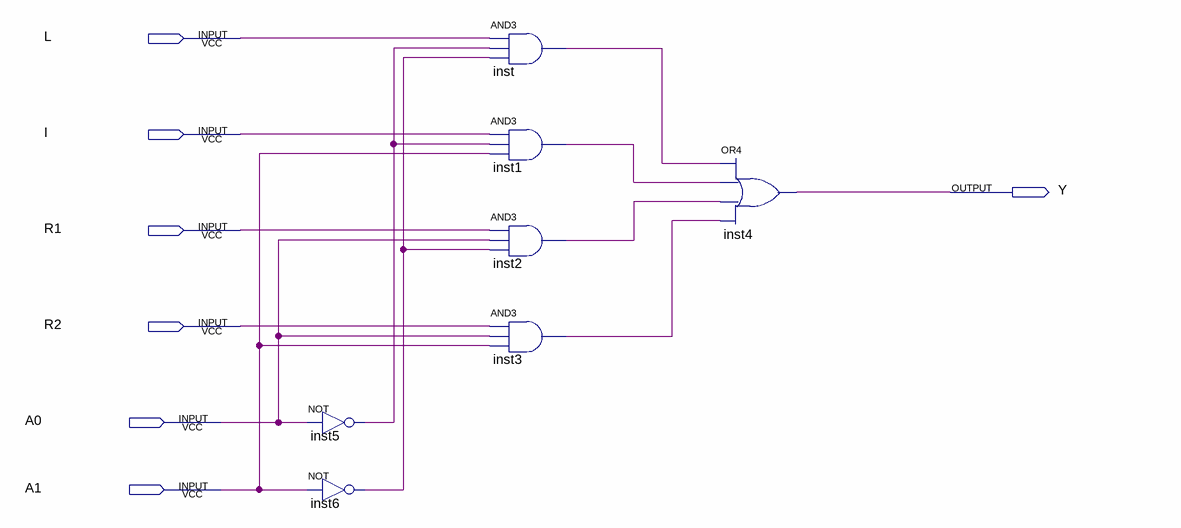
[diagram p0: schematic sheet]
// Quartus schematic choice2.bdf as structural Verilog: 7 symbols, 7 pins
module choice2 (
  input  L,
  input  I,
  input  R1,
  input  R2,
  input  A0,
  input  A1,
  output Y
);

  wire inst1_out, inst2_out, inst3_out, inst5_out, inst6_out, inst_out;

  not inst5 (inst5_out, A0);
  not inst6 (inst6_out, A1);
  and inst (inst_out, L, inst5_out, inst6_out);
  and inst1 (inst1_out, I, inst5_out, A1);
  and inst2 (inst2_out, R1, A0, inst6_out);
  and inst3 (inst3_out, R2, A0, A1);
  or inst4 (Y, inst_out, inst1_out, inst2_out, inst3_out);
endmodule
